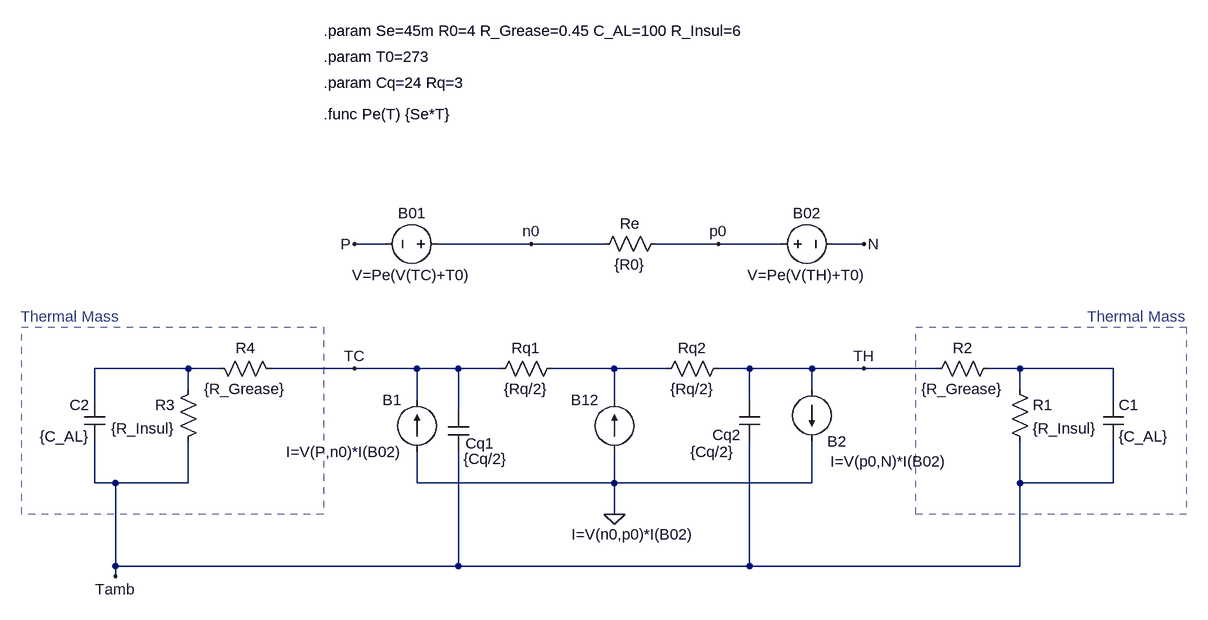
[diagram p0: schematic tec_mass.asc]
tec_mass.asc, the LTspice schematic file:
Version 4
SHEET 1 1244 900
WIRE 0 208 -48 208
WIRE 224 208 80 208
WIRE 336 208 224 208
WIRE 512 208 416 208
WIRE 608 208 512 208
WIRE 736 208 688 208
WIRE -304 400 -448 400
WIRE -256 400 -304 400
WIRE -48 400 -176 400
WIRE 48 400 -48 400
WIRE 112 400 48 400
WIRE 176 400 112 400
WIRE 352 400 256 400
WIRE 432 400 352 400
WIRE 560 400 512 400
WIRE 656 400 560 400
WIRE 736 400 656 400
WIRE 848 400 736 400
WIRE 976 400 928 400
WIRE 1120 400 976 400
WIRE -304 432 -304 400
WIRE 656 432 656 400
WIRE 976 432 976 400
WIRE -448 448 -448 400
WIRE 48 448 48 400
WIRE 352 448 352 400
WIRE 560 448 560 400
WIRE 1120 448 1120 400
WIRE 112 464 112 400
WIRE -448 576 -448 512
WIRE -416 576 -448 576
WIRE -304 576 -304 512
WIRE -304 576 -416 576
WIRE 48 576 48 528
WIRE 352 576 352 528
WIRE 352 576 48 576
WIRE 656 576 656 512
WIRE 656 576 352 576
WIRE 976 576 976 512
WIRE 1120 576 1120 512
WIRE 1120 576 976 576
WIRE 352 624 352 576
WIRE -416 704 -416 576
WIRE 112 704 112 528
WIRE 112 704 -416 704
WIRE 560 704 560 512
WIRE 560 704 112 704
WIRE 976 704 976 576
WIRE 976 704 560 704
WIRE -416 720 -416 704
FLAG -48 208 P
FLAG 736 208 N
FLAG -48 400 TC
FLAG 736 400 TH
FLAG 352 624 0
FLAG 224 208 n0
FLAG 512 208 p0
FLAG -416 720 Tamb
SYMBOL voltage 96 208 R90
WINDOW 0 -32 56 VBottom 2
WINDOW 3 32 56 VTop 2
WINDOW 123 0 0 Left 0
WINDOW 39 0 0 Left 0
SYMATTR InstName B01
SYMATTR Value V=Pe(V(TC)+T0)
SYMBOL voltage 592 208 R270
WINDOW 0 32 56 VTop 2
WINDOW 3 -32 56 VBottom 2
WINDOW 123 0 0 Left 0
WINDOW 39 0 0 Left 0
SYMATTR InstName B02
SYMATTR Value V=Pe(V(TH)+T0)
SYMBOL res 432 192 R90
WINDOW 0 0 56 VBottom 2
WINDOW 3 32 56 VTop 2
SYMATTR InstName Re
SYMATTR Value {R0}
SYMBOL current 48 528 R180
WINDOW 0 24 80 Left 2
WINDOW 3 24 0 Left 2
WINDOW 123 0 0 Left 0
WINDOW 39 0 0 Left 0
SYMATTR InstName B1
SYMATTR Value I=V(P,n0)*I(B02)
SYMBOL current 352 528 R180
WINDOW 0 24 80 Left 2
WINDOW 3 -123 -127 Left 2
WINDOW 123 0 0 Left 0
WINDOW 39 0 0 Left 0
SYMATTR InstName B12
SYMATTR Value I=V(n0,p0)*I(B02)
SYMBOL current 656 432 R0
WINDOW 0 24 80 Left 2
WINDOW 3 28 111 Left 2
WINDOW 123 0 0 Left 0
WINDOW 39 0 0 Left 0
SYMATTR InstName B2
SYMATTR Value I=V(p0,N)*I(B02)
SYMBOL cap 96 464 R0
WINDOW 0 27 51 Left 2
WINDOW 3 24 75 Left 2
SYMATTR InstName Cq1
SYMATTR Value {Cq/2}
SYMBOL res 272 384 R90
WINDOW 0 0 56 VBottom 2
WINDOW 3 32 56 VTop 2
SYMATTR InstName Rq1
SYMATTR Value {Rq/2}
SYMBOL res 528 384 R90
WINDOW 0 0 56 VBottom 2
WINDOW 3 32 56 VTop 2
SYMATTR InstName Rq2
SYMATTR Value {Rq/2}
SYMBOL cap 544 448 R0
WINDOW 0 -41 54 Left 2
WINDOW 3 -75 80 Left 2
SYMATTR InstName Cq2
SYMATTR Value {Cq/2}
SYMBOL res 960 416 R0
SYMATTR InstName R1
SYMATTR Value {R_Insul}
SYMBOL cap 1104 448 R0
SYMATTR InstName C1
SYMATTR Value {C_AL}
SYMBOL res 944 384 R90
WINDOW 0 0 56 VBottom 2
WINDOW 3 32 56 VTop 2
SYMATTR InstName R2
SYMATTR Value {R_Grease}
SYMBOL res -288 416 M0
SYMATTR InstName R3
SYMATTR Value {R_Insul}
SYMBOL cap -432 448 M0
SYMATTR InstName C2
SYMATTR Value {C_AL}
SYMBOL res -272 384 M90
WINDOW 0 0 56 VBottom 2
WINDOW 3 32 56 VTop 2
SYMATTR InstName R4
SYMATTR Value {R_Grease}
TEXT -96 8 Left 2 !.func Pe(T) {Se*T}
TEXT -96 -80 Left 2 !.param T0=273
TEXT -96 -40 Left 2 !.param Cq=24 Rq=3
TEXT -96 -120 Left 2 !.param Se=45m R0=4 R_Grease=0.45 C_AL=100 R_Insul=6
TEXT 1080 320 Left 2 ;Thermal Mass
TEXT -408 320 Right 2 ;Thermal Mass
RECTANGLE Normal 1232 624 816 336 2
RECTANGLE Normal -96 624 -560 336 2

The netlist it stands for:
* tec_mass.asc
V§B01 n0 P V=Pe(V(TC)+T0)
V§B02 p0 N V=Pe(V(TH)+T0)
Re p0 n0 {R0}
I§B1 0 TC I=V(P,n0)*I(B02)
I§B12 0 N002 I=V(n0,p0)*I(B02)
I§B2 TH 0 I=V(p0,N)*I(B02)
Cq1 TC Tamb {Cq/2}
Rq1 N002 TC {Rq/2}
Rq2 TH N002 {Rq/2}
Cq2 TH Tamb {Cq/2}
R1 N003 Tamb {R_Insul}
C1 N003 Tamb {C_AL}
R2 N003 TH {R_Grease}
R3 N001 Tamb {R_Insul}
C2 N001 Tamb {C_AL}
R4 N001 TC {R_Grease}
.func Pe(T) {Se*T}
.param T0=273
.param Cq=24 Rq=3
.param Se=45m R0=4 R_Grease=0.45 C_AL=100 R_Insul=6
* Thermal Mass
* Thermal Mass
.backanno
.end